# Altium schematic sheet CarrierConnector.SchDoc
size A4; CompanyName: Technische Hochschule Nürnberg Georg Simon Ohm; Organization: UltraZohm; Address1: Kesslerplatz 12; Address2: 90489 Nürnberg; Address3: GERMANY; DocumentNumber: 2; SheetNumber: 2; SheetTotal: 3; Website: www.ultrazohm.com
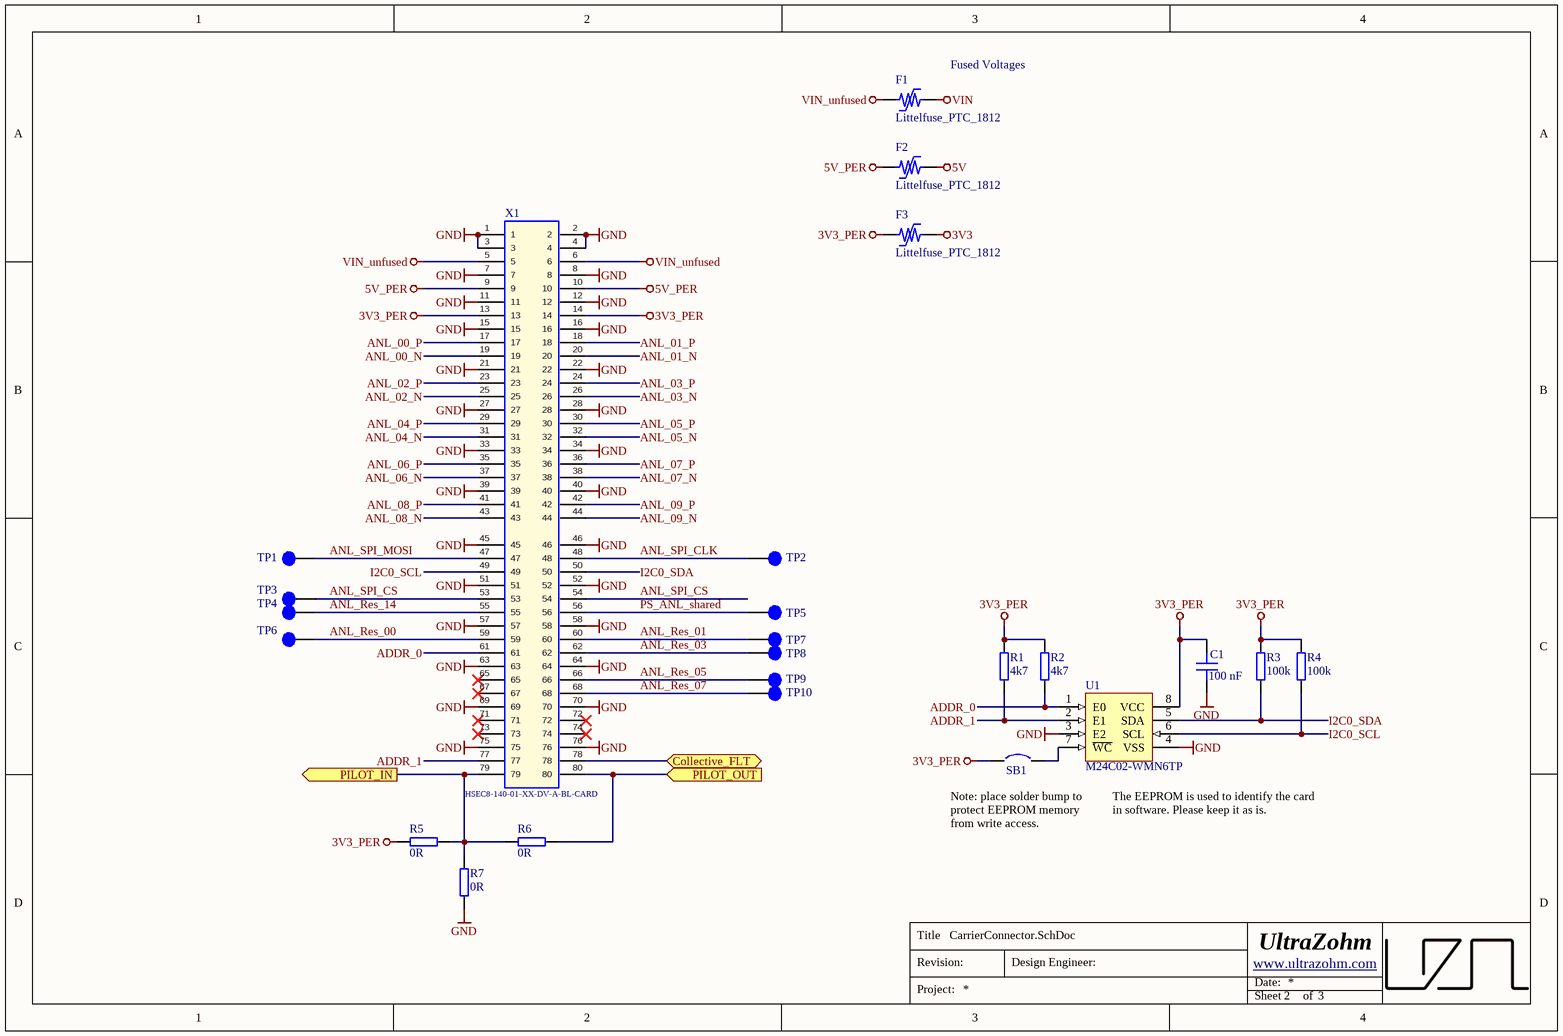
[diagram p0: CarrierConnector.SchDoc]

## Parts
C1  100 nF  [C_0603]
F1  Littelfuse_PTC_1812  [1812_PTC_Polyfuse_Littelfuse]
F2  Littelfuse_PTC_1812  [1812_PTC_Polyfuse_Littelfuse]
F3  Littelfuse_PTC_1812  [1812_PTC_Polyfuse_Littelfuse]
R1  4k7  [RES 0603_1608]
R2  4k7  [RES 0603_1608]
R3  100k  [RES 0603_1608]
R4  100k  [RES 0603_1608]
R5  0R  [RES 0603_1608]
R6  0R  [RES 0603_1608]
R7  0R  [RES 0603_1608]
SB1  Solder Bump 0603  [SB_0603]  (value not drawn)  (no BOM)
TP1  PIN47  [TP_1mm]  (value not drawn)
TP2  PIN48  [TP_1mm]  (value not drawn)
TP3  PIN53  [TP_1mm]  (value not drawn)
TP4  PIN53  [TP_1mm]  (value not drawn)
TP5  PIN56  [TP_1mm]  (value not drawn)
TP6  PIN53  [TP_1mm]  (value not drawn)
TP7  PIN53  [TP_1mm]  (value not drawn)
TP8  PIN53  [TP_1mm]  (value not drawn)
TP9  PIN53  [TP_1mm]  (value not drawn)
TP10  PIN53  [TP_1mm]  (value not drawn)
U1  M24C02-WMN6TP  [D0008A_N]
X1  HSEC8-140-01-XX-DV-A-BL-CARD  [HSEC8-140-01-XX-DV-A-BL-CARD]

## Ports
Collective_FLT (bidir), PILOT_IN (out), PILOT_OUT (in)

## Nets
3V3: F3.2
3V3_PER: C1.1 F3.1 R1.2 R2.2 R3.2 R4.2 R5.1 SB1.1 U1.8(VCC) X1.13 X1.14
5V: F2.2
5V_PER: F2.1 X1.9 X1.10
GND: C1.2 R7.1 U1.3(E2) U1.4(VSS) X1.1 X1.2 X1.3 X1.4 X1.7 X1.8 X1.11 X1.12 X1.15 X1.16 X1.21 X1.22 X1.27 X1.28 X1.33 X1.34 X1.39 X1.40 X1.45 X1.46 X1.51 X1.52 X1.57 X1.58 X1.63 X1.64 X1.69 X1.70 X1.75 X1.76
VIN: F1.2
VIN_unfused: F1.1 X1.5 X1.6
ADDR_0: R2.1 U1.1(E0) X1.61
ADDR_1: R1.1 U1.2(E1) X1.77
ANL_00_N: X1.19
ANL_00_P: X1.17
ANL_01_N: X1.20
ANL_01_P: X1.18
ANL_02_N: X1.25
ANL_02_P: X1.23
ANL_03_N: X1.26
ANL_03_P: X1.24
ANL_04_N: X1.31
ANL_04_P: X1.29
ANL_05_N: X1.32
ANL_05_P: X1.30
ANL_06_N: X1.37
ANL_06_P: X1.35
ANL_07_N: X1.38
ANL_07_P: X1.36
ANL_08_N: X1.43
ANL_08_P: X1.41
ANL_09_N: X1.44
ANL_09_P: X1.42
ANL_Res_00: TP6.1 X1.59
ANL_Res_01: TP7.1 X1.60
ANL_Res_03: TP8.1 X1.62
ANL_Res_05: TP9.1 X1.66
ANL_Res_07: TP10.1 X1.68
ANL_Res_14: TP4.1 X1.55
ANL_SPI_CLK: TP2.1 X1.48
ANL_SPI_CS: TP3.1 X1.53 X1.54
ANL_SPI_MOSI: TP1.1 X1.47
Collective_FLT: X1.78 ; port Collective_FLT
I2C0_SCL: R4.1 U1.6(SCL) X1.49
I2C0_SDA: R3.1 U1.5(SDA) X1.50
PILOT_IN: R5.2 R6.1 R7.2 X1.79 ; port PILOT_IN
PILOT_OUT: R6.2 X1.80 ; port PILOT_OUT
PS_ANL_shared: TP5.1 X1.56
NetSB1_2: SB1.2 U1.7(~{WC})

Not connected (* = marked no-connect by the designer): X1 65* 67* 71* 72* 73* 74*

## Notes on the sheet
- (near F1) Fused Voltages
- Note: place solder bump to protect EEPROM memory from write access.
- (near U1) The EEPROM is used to identify the card in software. Please keep it as is.
- Title
- Revision:
- Design Engineer:
- Date:
- Project:
- Sheet
- of

## Library data of the parts
C1 = C0603C104K9PACTU: Capacitor 0603, 6.3 VDC, 100 nF, X5R; Manufacturer: KEMET; Tolerance: 10 %; Voltage Rating: 6.3 VDC; Created from: MGremer; Manufacturer Part Number: C0603C104K9PACTU; PartID: 70; Created On: 20.12.2020 13:54:13; ComponentLink1Description: Datasheet; ComponentLink1URL: https://www.mouser.de/datasheet/2/212/KEM_C1006_X5R_SMD-1103249.pdf; Component Type: Capacitor 0603; Device Package: 0603; Last Updated: 20.01.2021 13:57:36; Mounting Type: SMD; Operating Temperature: -55 - 85°C; Series: SMD Comm X5R; Supplier 1: Mouser; Supplier Part Number 1: 80-C0603C104K9P; Type: Capacitor; Value: 100 nF; Live Cycle Status: 1; Stock number: not stored
F1-F3 = Littelfuse_PTC_1812: POLYSWITCH RESETTABLE DEVICES; MPN: miniASMDC110F/24; Value: PTC, 1.1 A, 24V; Voltage: 24V; Trip Current: 2.2A; Hold Current: 1.1A; Resistance: 0.18 Ohm; Type: Fuse; Nominal current: 1 A; Created from: MHlatky; MF: Littelfuse; Created: 2019_02_10_AGeiger; Package: 1812; ComponentLink1URL: https://www.littelfuse.com/~/media/electronics/datasheets/resettable_ptcs/littelfuse_ptc_surface_mount_catalog_datasheet.pdf.pdf; ComponentLink1Description: Datasheet; Manufacturer Part Number: Littelfuse_PTC_1812; PartID: 5; Created On: 07.05.2021 06:50:33; Component Type: Littelfuse_PTC_1812; Last Updated: 27.05.2022 15:06:17; Manufacturer: Littelfuse; Mounting Type: SMD; Operating Temperature: -40 - 85 °C; Supplier 1: Mouser; Supplier Part Number 1: 530-0ZCG0150BF2C; Live Cycle Status: 1; LCSC Part Number: C70119
R1 R2 = 0603WAF4701T5E: SMD resistor E24 series; Manufacturer: UNI-ROYAL; Tolerance: 1%; Created from: AGeiger; Manufacturer Part Number: 0603WAF4701T5E; PartID: 90; Created On: 14.12.2020 16:17:14; ComponentLink1Description: Datasheet; ComponentLink1URL: https://datasheet.lcsc.com/lcsc/2206010116_UNI-ROYAL-Uniroyal-Elec-0603WAF4701T5E_C23162.pdf; Component Type: SMD resistor; Device Package: 0603; Last Updated: 25.08.2022 20:03:04; Mounting Type: SMD; Supplier 1: LCSC; Supplier Part Number 1: C23162; Type: Resistor; Value: 4k7; Live Cycle Status: 1; Stock number: Labor SMD Container; LCSC Part Number: C23162
R3 R4 = RK73B1JTTD104J: SMD resistor E24 series; Manufacturer: KOA Speer; Tolerance: 5%; Created from: MGremer; Manufacturer Part Number: RK73B1JTTD104J; PartID: 122; Created On: 14.12.2020 16:17:14; ComponentLink1Description: Datasheet; ComponentLink1URL: https://www.mouser.de/datasheet/2/219/RK73B-1825463.pdf; Component Type: SMD resistor; Device Package: 0603; Last Updated: 27.05.2022 14:04:10; Mounting Type: SMD; Supplier 1: Mouser; Supplier Part Number 1: 660-RK73B1JTTD104J; Type: Resistor; Value: 100k; Live Cycle Status: 1; Stock number: Labor SMD Container; LCSC Part Number: C25803
R5-R7 = RC0603JR-070RL: SMD resistor E24 series; Manufacturer: YAGEO; Tolerance: 5%; Created from: MGremer; Manufacturer Part Number: RC0603JR-070RL; PartID: 1; Created On: 14.12.2020 16:17:14; ComponentLink1Description: Datasheet; ComponentLink1URL: https://www.mouser.de/datasheet/2/447/PYu-RC_Group_51_RoHS_L_10-1664068.pdf; Component Type: SMD resistor; Device Package: 0603; Last Updated: 04.03.2021 09:09:42; Mounting Type: SMD; Supplier 1: Mouser; Supplier Part Number 1: 603-RC0603JR-070RL; Supplier 2: LCSC; Supplier Part Number 2: C21189; Type: Resistor; Value: 0R; Live Cycle Status: 1; Stock number: Labor SMD Container; LCSC Part Number: C21189
SB1 = =Value: Created from: AGeiger; Revision: July-2002: Re-released for DXP Platform.; PartID: 1; Created On: 09.01.2024 17:13:56; Component Type: Solder Bump; Device Package: 0603; Last Updated: 09.01.2024 17:13:56; Manufacturer Part Number: Solder Bump 0603; Mounting Type: SMD; Value: Solder Bump 0603
TP1-TP10 = TP_1mm: Testpoint 1mm; Created: 2018_06_25_AGeiger; Value: Testpoint 1mm
U1 = M24C02-WMN6TP: 2Kbit I2C SOP-8 EEPROM ROHS; Manufacturer: STMicroelectronics; Created from: AGeiger; Manufacturer Part Number: M24C02-WMN6TP; PartID: 1; Created On: 19.11.2023 14:54:27; ComponentLink1Description: Datasheet; ComponentLink1URL: https://www.st.com/resource/en/datasheet/m24c01-w.pdf; Component Type: EEPROM; Device Package: SOIC-8; Last Updated: 19.11.2023 21:39:04; Mounting Type: SMD; Operating Temperature: -40 to +85 °C; Series: M24xxx; Supplier 1: Mouser; Supplier Part Number 1: 511-M24C02-WMN6TP; Supplier 2: LCSC; Supplier Part Number 2: C7562; Type: Memory; Value: M24C02-WMN6TP; LCSC Part Number: C7562
X1 = HSEC8-140-01-XX-DV-A-BL-CARD: Mating Card Layout for HSEC8-140-01-XX-DV-A-BL; Manufacturer: SAMTEC; Created: 2018_04_23_AGeiger; Value: HSEC8-140-01-XX-DV-A-BL-CARD